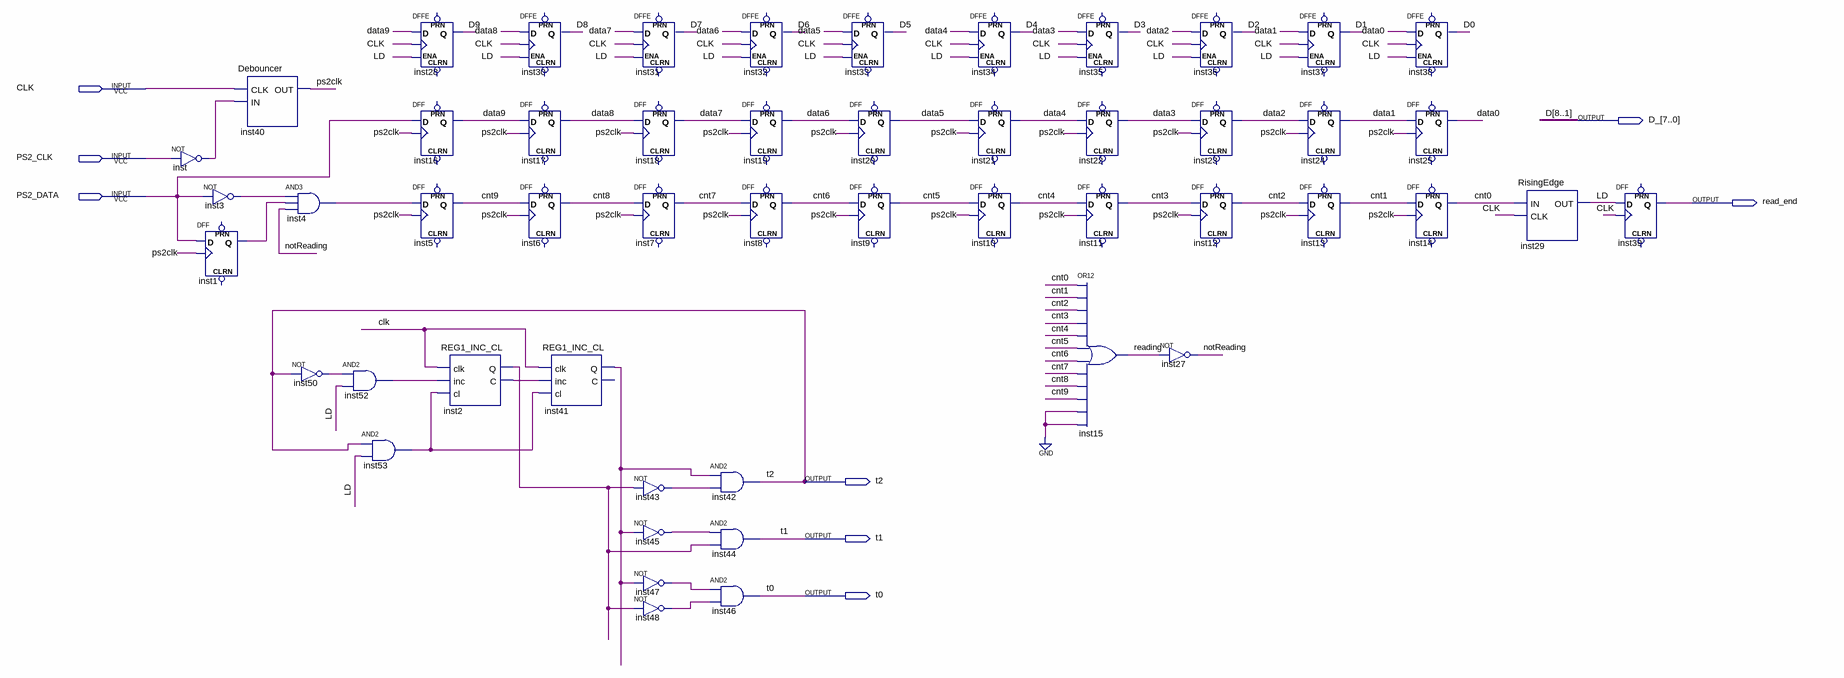
[diagram p0: schematic sheet]
// Quartus schematic Lab1Demo.bdf as structural Verilog: 51 symbols, 8 pins
module Lab1Demo (
  input  CLK,
  input  PS2_CLK,
  input  PS2_DATA,
  output [7:0] D_,
  output read_end,
  output t2,
  output t1,
  output t0
);

  wire cnt0, cnt1, cnt2, cnt3, cnt4, cnt5, cnt6, cnt7, cnt8, cnt9, D0, D9, data0, data1, data2, data3, data4,
       data5, data6, data7, data8, data9, inst1_q, inst2_c, inst2_q, inst3_out, inst4_out, inst41_q,
       inst43_out, inst45_out, inst47_out, inst48_out, inst50_out, inst52_out, inst53_out, inst_out, LD,
       notReading, ps2clk, reading;

  not inst (inst_out, PS2_CLK);
  Debouncer inst40 (.CLK(CLK), .IN(inst_out), .OUT(ps2clk));
  not inst3 (inst3_out, PS2_DATA);
  DFF inst1 (.CLK(ps2clk), .D(PS2_DATA), .Q(inst1_q));  // open: CLRN, PRN
  and inst4 (inst4_out, inst3_out, inst1_q, notReading);
  not inst50 (inst50_out, t2);
  and inst52 (inst52_out, inst50_out, LD);
  and inst53 (inst53_out, t2, LD);
  DFFE inst28 (.D(data9), .CLK(CLK), .ENA(LD), .Q(D9));  // open: PRN, CLRN
  DFF inst16 (.CLK(ps2clk), .D(PS2_DATA), .Q(data9));  // open: CLRN, PRN
  DFF inst5 (.CLK(ps2clk), .D(inst4_out), .Q(cnt9));  // open: CLRN, PRN
  REG1_INC_CL inst2 (.clk(CLK), .inc(inst52_out), .cl(inst53_out), .Q(inst2_q), .C(inst2_c));
  DFFE inst30 (.D(data8), .CLK(CLK), .ENA(LD), .Q(D_[7]));  // open: PRN, CLRN
  DFF inst17 (.CLK(ps2clk), .D(data9), .Q(data8));  // open: CLRN, PRN
  DFF inst6 (.CLK(ps2clk), .D(cnt9), .Q(cnt8));  // open: CLRN, PRN
  REG1_INC_CL inst41 (.clk(CLK), .inc(inst2_c), .cl(inst53_out), .Q(inst41_q));  // open: C
  DFFE inst31 (.D(data7), .CLK(CLK), .ENA(LD), .Q(D_[6]));  // open: PRN, CLRN
  DFF inst18 (.CLK(ps2clk), .D(data8), .Q(data7));  // open: CLRN, PRN
  DFF inst7 (.CLK(ps2clk), .D(cnt8), .Q(cnt7));  // open: CLRN, PRN
  not inst43 (inst43_out, inst2_q);
  not inst45 (inst45_out, inst41_q);
  not inst47 (inst47_out, inst41_q);
  not inst48 (inst48_out, inst2_q);
  DFFE inst32 (.D(data6), .CLK(CLK), .ENA(LD), .Q(D_[5]));  // open: PRN, CLRN
  DFF inst19 (.CLK(ps2clk), .D(data7), .Q(data6));  // open: CLRN, PRN
  DFF inst8 (.CLK(ps2clk), .D(cnt7), .Q(cnt6));  // open: CLRN, PRN
  and inst42 (t2, inst41_q, inst43_out);
  and inst44 (t1, inst45_out, inst2_q);
  and inst46 (t0, inst47_out, inst48_out);
  DFFE inst33 (.D(data5), .CLK(CLK), .ENA(LD), .Q(D_[4]));  // open: PRN, CLRN
  DFF inst20 (.CLK(ps2clk), .D(data6), .Q(data5));  // open: CLRN, PRN
  DFF inst9 (.CLK(ps2clk), .D(cnt6), .Q(cnt5));  // open: CLRN, PRN
  DFFE inst34 (.D(data4), .CLK(CLK), .ENA(LD), .Q(D_[3]));  // open: PRN, CLRN
  DFF inst21 (.CLK(ps2clk), .D(data5), .Q(data4));  // open: CLRN, PRN
  DFF inst10 (.CLK(ps2clk), .D(cnt5), .Q(cnt4));  // open: CLRN, PRN
  DFFE inst35 (.D(data3), .CLK(CLK), .ENA(LD), .Q(D_[2]));  // open: PRN, CLRN
  DFF inst22 (.CLK(ps2clk), .D(data4), .Q(data3));  // open: CLRN, PRN
  DFF inst11 (.CLK(ps2clk), .D(cnt4), .Q(cnt3));  // open: CLRN, PRN
  or inst15 (reading, cnt0, cnt1, cnt2, cnt3, cnt4, cnt5, cnt6, cnt7, cnt8, cnt9, 1'b0, 1'b0);
  DFFE inst36 (.D(data2), .CLK(CLK), .ENA(LD), .Q(D_[1]));  // open: PRN, CLRN
  DFF inst23 (.CLK(ps2clk), .D(data3), .Q(data2));  // open: CLRN, PRN
  DFF inst12 (.CLK(ps2clk), .D(cnt3), .Q(cnt2));  // open: CLRN, PRN
  not inst27 (notReading, reading);
  DFFE inst37 (.D(data1), .CLK(CLK), .ENA(LD), .Q(D_[0]));  // open: PRN, CLRN
  DFF inst24 (.CLK(ps2clk), .D(data2), .Q(data1));  // open: CLRN, PRN
  DFF inst13 (.CLK(ps2clk), .D(cnt2), .Q(cnt1));  // open: CLRN, PRN
  DFFE inst38 (.D(data0), .CLK(CLK), .ENA(LD), .Q(D0));  // open: PRN, CLRN
  DFF inst25 (.CLK(ps2clk), .D(data1), .Q(data0));  // open: CLRN, PRN
  DFF inst14 (.CLK(ps2clk), .D(cnt1), .Q(cnt0));  // open: CLRN, PRN
  RisingEdge inst29 (.IN(cnt0), .CLK(CLK), .OUT(LD));
  DFF inst39 (.CLK(CLK), .D(LD), .Q(read_end));  // open: CLRN, PRN

  // Other names for the same wires on the sheet: D[8:1] = D_; D1 = D_[0]; D2 = D_[1]; D3 = D_[2]; D4 = D_[3];
  //   D5 = D_[4]; D6 = D_[5]; D7 = D_[6]; D8 = D_[7]
endmodule
